# Altium schematic sheet SODIMM_Connector.SchDoc
size A3; CompanyName: Group 19 - AIgle; DrawnBy: Danny Huang; SheetNumber: 2; SheetTotal: 3
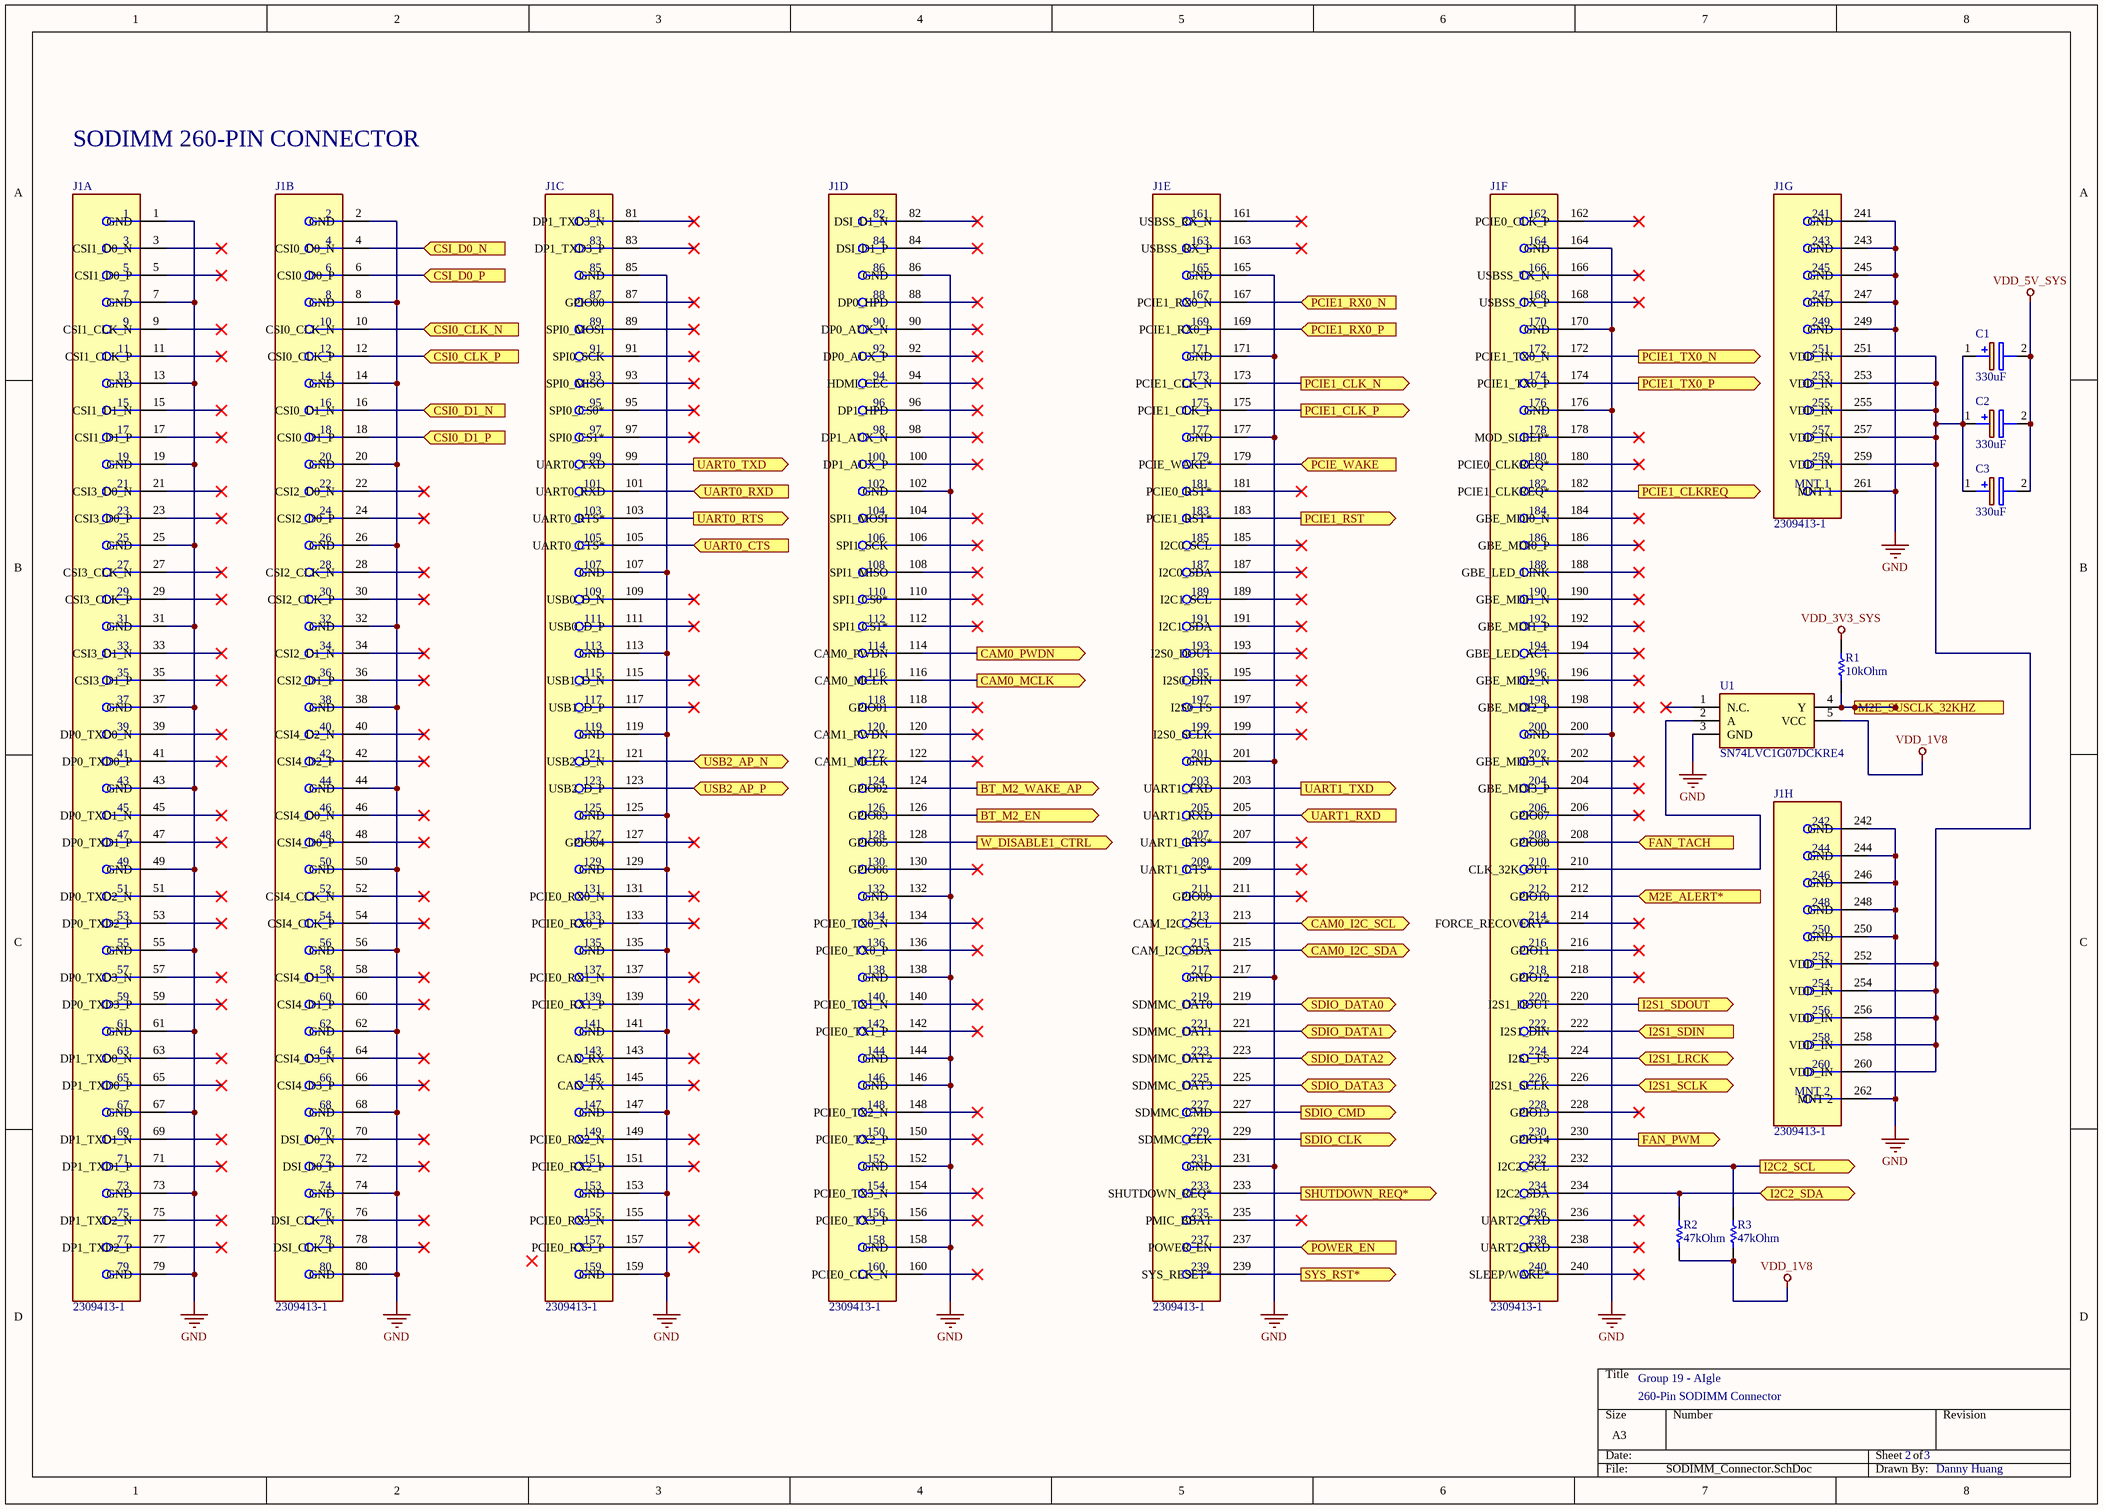
[diagram p0: SODIMM_Connector.SchDoc]

## Parts
C1  330uF  [CAPPM3528X210N]
C2  330uF  [CAPPM3528X210N]
C3  330uF  [CAPPM3528X210N]
J1  2309413-1  [FP-2309413-1-MFG]  (parts A,B,C,D,E,F,G,H of 8)
R1  10kOhm  [RESC1005X40X25NL05T05]
R2  47kOhm  [RESC1005X40X25LL05T05]
R3  47kOhm  [RESC1005X40X25LL05T05]
U1  SN74LVC1G07DCKRE4  [SOT65P210X110-5N]

## Ports
BT_M2_EN (out), BT_M2_WAKE_AP (out), CAM0_I2C_SCL (bidir), CAM0_I2C_SDA (bidir), CAM0_MCLK (out), CAM0_PWDN (out), CSI0_CLK_N (in), CSI0_CLK_P (in), CSI0_D1_N (in), CSI0_D1_P (in), CSI_D0_N (in), CSI_D0_P (in), FAN_PWM (out), FAN_TACH (in), I2C2_SCL (out), I2C2_SDA (bidir), I2S1_LRCK (bidir), I2S1_SCLK (bidir), I2S1_SDIN (in), I2S1_SDOUT (out), M2E_ALERT* (in), M2E_SUSCLK_32KHZ (out), PCIE1_CLK_N (out), PCIE1_CLK_P (out), PCIE1_CLKREQ (out), PCIE1_RST (out), PCIE1_RX0_N (in), PCIE1_RX0_P (in), PCIE1_TX0_N (out), PCIE1_TX0_P (out), PCIE_WAKE (in), POWER_EN (in), SDIO_CLK (out), SDIO_CMD (out), SDIO_DATA0 (bidir), SDIO_DATA1 (bidir), SDIO_DATA2 (bidir), SDIO_DATA3 (bidir), SHUTDOWN_REQ* (out), SYS_RST* (out), UART0_CTS (in), UART0_RTS (out), UART0_RXD (in), UART0_TXD (out), UART1_RXD (in), UART1_TXD (out), USB2_AP_N (bidir), USB2_AP_P (bidir), W_DISABLE1_CTRL (out)

## Nets
GND: J1.1(GND) J1.2(GND) J1.7(GND) J1.8(GND) J1.13(GND) J1.14(GND) J1.19(GND) J1.20(GND) J1.25(GND) J1.26(GND) J1.31(GND) J1.32(GND) J1.37(GND) J1.38(GND) J1.43(GND) J1.44(GND) J1.49(GND) J1.50(GND) J1.55(GND) J1.56(GND) J1.61(GND) J1.62(GND) J1.67(GND) J1.68(GND) J1.73(GND) J1.74(GND) J1.79(GND) J1.80(GND) J1.85(GND) J1.86(GND) J1.102(GND) J1.107(GND) J1.113(GND) J1.119(GND) J1.125(GND) J1.129(GND) J1.132(GND) J1.135(GND) J1.138(GND) J1.141(GND) J1.144(GND) J1.146(GND) J1.147(GND) J1.152(GND) J1.153(GND) J1.158(GND) J1.159(GND) J1.164(GND) J1.165(GND) J1.170(GND) J1.171(GND) J1.176(GND) J1.177(GND) J1.200(GND) J1.201(GND) J1.217(GND) J1.231(GND) J1.241(GND) J1.242(GND) J1.243(GND) J1.244(GND) J1.245(GND) J1.246(GND) J1.247(GND) J1.248(GND) J1.249(GND) J1.250(GND) J1.261(MNT_1) J1.262(MNT_2) U1.3(GND)
VDD_1V8: R2.1 R3.1 U1.5(VCC)
VDD_3V3_SYS: R1.2
VDD_5V_SYS: C1.2(-) C2.2(-) C3.2(-)
BT_M2_EN: J1.126(GPIO03) ; port BT_M2_EN
BT_M2_WAKE_AP: J1.124(GPIO02) ; port BT_M2_WAKE_AP
CAM0_I2C_SCL: J1.213(CAM_I2C_SCL) ; port CAM0_I2C_SCL
CAM0_I2C_SDA: J1.215(CAM_I2C_SDA) ; port CAM0_I2C_SDA
CAM0_MCLK: J1.116(CAM0_MCLK) ; port CAM0_MCLK
CAM0_PWDN: J1.114(CAM0_PWDN) ; port CAM0_PWDN
CSI0_CLK_N: J1.10(CSI0_CLK_N) ; port CSI0_CLK_N
CSI0_CLK_P: J1.12(CSI0_CLK_P) ; port CSI0_CLK_P
CSI0_D1_N: J1.16(CSI0_D1_N) ; port CSI0_D1_N
CSI0_D1_P: J1.18(CSI0_D1_P) ; port CSI0_D1_P
CSI_D0_N: J1.4(CSI0_D0_N) ; port CSI_D0_N
CSI_D0_P: J1.6(CSI0_D0_P) ; port CSI_D0_P
FAN_PWM: J1.230(GPIO14) ; port FAN_PWM
FAN_TACH: J1.208(GPIO08) ; port FAN_TACH
I2C2_SCL: J1.232(I2C2_SCL) R3.2 ; port I2C2_SCL
I2C2_SDA: J1.234(I2C2_SDA) R2.2 ; port I2C2_SDA
I2S1_LRCK: J1.224(I2S1_FS) ; port I2S1_LRCK
I2S1_SCLK: J1.226(I2S1_SCLK) ; port I2S1_SCLK
I2S1_SDIN: J1.222(I2S1_DIN) ; port I2S1_SDIN
I2S1_SDOUT: J1.220(I2S1_DOUT) ; port I2S1_SDOUT
M2E_ALERT*: J1.212(GPIO10) ; port M2E_ALERT*
M2E_SUSCLK_32KHZ: R1.1 U1.4(Y) ; port M2E_SUSCLK_32KHZ
PCIE1_CLK_N: J1.173(PCIE1_CLK_N) ; port PCIE1_CLK_N
PCIE1_CLK_P: J1.175(PCIE1_CLK_P) ; port PCIE1_CLK_P
PCIE1_CLKREQ: J1.182(PCIE1_CLKREQ*) ; port PCIE1_CLKREQ
PCIE1_RST: J1.183(PCIE1_RST*) ; port PCIE1_RST
PCIE1_RX0_N: J1.167(PCIE1_RX0_N) ; port PCIE1_RX0_N
PCIE1_RX0_P: J1.169(PCIE1_RX0_P) ; port PCIE1_RX0_P
PCIE1_TX0_N: J1.172(PCIE1_TX0_N) ; port PCIE1_TX0_N
PCIE1_TX0_P: J1.174(PCIE1_TX0_P) ; port PCIE1_TX0_P
PCIE_WAKE: J1.179(PCIE_WAKE*) ; port PCIE_WAKE
POWER_EN: J1.237(POWER_EN) ; port POWER_EN
SDIO_CLK: J1.229(SDMMC_CLK) ; port SDIO_CLK
SDIO_CMD: J1.227(SDMMC_CMD) ; port SDIO_CMD
SDIO_DATA0: J1.219(SDMMC_DAT0) ; port SDIO_DATA0
SDIO_DATA1: J1.221(SDMMC_DAT1) ; port SDIO_DATA1
SDIO_DATA2: J1.223(SDMMC_DAT2) ; port SDIO_DATA2
SDIO_DATA3: J1.225(SDMMC_DAT3) ; port SDIO_DATA3
SHUTDOWN_REQ*: J1.233(SHUTDOWN_REQ*) ; port SHUTDOWN_REQ*
SYS_RST*: J1.239(SYS_RESET*) ; port SYS_RST*
UART0_CTS: J1.105(UART0_CTS*) ; port UART0_CTS
UART0_RTS: J1.103(UART0_RTS*) ; port UART0_RTS
UART0_RXD: J1.101(UART0_RXD) ; port UART0_RXD
UART0_TXD: J1.99(UART0_TXD) ; port UART0_TXD
UART1_RXD: J1.205(UART1_RXD) ; port UART1_RXD
UART1_TXD: J1.203(UART1_TXD) ; port UART1_TXD
USB2_AP_N: J1.121(USB2_D_N) ; port USB2_AP_N
USB2_AP_P: J1.123(USB2_D_P) ; port USB2_AP_P
W_DISABLE1_CTRL: J1.128(GPIO05) ; port W_DISABLE1_CTRL
NetC1_1: C1.1(+) C2.1(+) C3.1(+) J1.251(VDD_IN) J1.252(VDD_IN) J1.253(VDD_IN) J1.254(VDD_IN) J1.255(VDD_IN) J1.256(VDD_IN) J1.257(VDD_IN) J1.258(VDD_IN) J1.259(VDD_IN) J1.260(VDD_IN)
NetJ1_210: J1.210(CLK_32K_OUT) U1.2(A)

Not connected (* = marked no-connect by the designer): J1 3(CSI1_D0_N)* 5(CSI1_D0_P)* 9(CSI1_CLK_N)* 11(CSI1_CLK_P)* 15(CSI1_D1_N)* 17(CSI1_D1_P)* 21(CSI3_D0_N)* 22(CSI2_D0_N)* 23(CSI3_D0_P)* 24(CSI2_D0_P)* 27(CSI3_CLK_N)* 28(CSI2_CLK_N)* 29(CSI3_CLK_P)* 30(CSI2_CLK_P)* 33(CSI3_D1_N)* 34(CSI2_D1_N)* 35(CSI3_D1_P)* 36(CSI2_D1_P)* 39(DP0_TXD0_N)* 40(CSI4_D2_N)* 41(DP0_TXD0_P)* 42(CSI4_D2_P)* 45(DP0_TXD1_N)* 46(CSI4_D0_N)* 47(DP0_TXD1_P)* 48(CSI4_D0_P)* 51(DP0_TXD2_N)* 52(CSI4_CLK_N)* 53(DP0_TXD2_P)* 54(CSI4_CLK_P)* 57(DP0_TXD3_N)* 58(CSI4_D1_N)* 59(DP0_TXD3_P)* 60(CSI4_D1_P)* 63(DP1_TXD0_N)* 64(CSI4_D3_N)* 65(DP1_TXD0_P)* 66(CSI4_D3_P)* 69(DP1_TXD1_N)* 70(DSI_D0_N)* 71(DP1_TXD1_P)* 72(DSI_D0_P)* 75(DP1_TXD2_N)* 76(DSI_CLK_N)* 77(DP1_TXD2_P)* 78(DSI_CLK_P)* 81(DP1_TXD3_N)* 82(DSI_D1_N)* 83(DP1_TXD3_P)* 84(DSI_D1_P)* 87(GPIO00)* 88(DP0_HPD)* 89(SPI0_MOSI)* 90(DP0_AUX_N)* 91(SPI0_SCK)* 92(DP0_AUX_P)* 93(SPI0_MISO)* 94(HDMI_CEC)* 95(SPI0_CS0*)* 96(DP1_HPD)* 97(SPI0_CS1*)* 98(DP1_AUX_N)* 100(DP1_AUX_P)* 104(SPI1_MOSI)* 106(SPI1_SCK)* 108(SPI1_MISO)* 109(USB0_D_N)* 110(SPI1_CS0*)* 111(USB0_D_P)* 112(SPI1_CS1*)* 115(USB1_D_N)* 117(USB1_D_P)* 118(GPIO01)* 120(CAM1_PWDN)* 122(CAM1_MCLK)* 127(GPIO04)* 130(GPIO06)* 131(PCIE0_RX0_N)* 133(PCIE0_RX0_P)* 134(PCIE0_TX0_N)* 136(PCIE0_TX0_P)* 137(PCIE0_RX1_N)* 139(PCIE0_RX1_P)* 140(PCIE0_TX1_N)* 142(PCIE0_TX1_P)* 143(CAN_RX)* 145(CAN_TX)* 148(PCIE0_TX2_N)* 149(PCIE0_RX2_N)* 150(PCIE0_TX2_P)* 151(PCIE0_RX2_P)* 154(PCIE0_TX3_N)* 155(PCIE0_RX3_N)* 156(PCIE0_TX3_P)* 157(PCIE0_RX3_P)* 160(PCIE0_CLK_N)* 161(USBSS_RX_N)* 162(PCIE0_CLK_P)* 163(USBSS_RX_P)* 166(USBSS_TX_N)* 168(USBSS_TX_P)* 178(MOD_SLEEP*)* 180(PCIE0_CLKREQ*)* 181(PCIE0_RST*)* 184(GBE_MDI0_N)* 185(I2C0_SCL)* 186(GBE_MDI0_P)* 187(I2C0_SDA)* 188(GBE_LED_LINK)* 189(I2C1_SCL)* 190(GBE_MDI1_N)* 191(I2C1_SDA)* 192(GBE_MDI1_P)* 193(I2S0_DOUT)* 194(GBE_LED_ACT)* 195(I2S0_DIN)* 196(GBE_MDI2_N)* 197(I2S0_FS)* 198(GBE_MDI2_P)* 199(I2S0_SCLK)* 202(GBE_MDI3_N)* 204(GBE_MDI3_P)* 206(GPIO07)* 207(UART1_RTS*)* 209(UART1_CTS*)* 211(GPIO09)* 214(FORCE_RECOVERY*)* 216(GPIO11)* 218(GPIO12)* 228(GPIO13)* 235(PMIC_BBAT)* 236(UART2_TXD)* 238(UART2_RXD)* 240(SLEEP/WAKE*)*; U1 1(N.C.)*

## Notes on the sheet
- SODIMM 260-PIN CONNECTOR
- 260-Pin SODIMM Connector

## Library data of the parts
C1-C3 = T520B337M006ATE040: Capacitor Polarised; Manufacturer_Name: Kemet; Datasheet Link: http://componentsearchengine.com/Datasheets/2/T520B337M006ATE040.pdf; Height: 2.1mm; Manufacturer_Part_Number: T520B337M006ATE040; Arrow Part Number: T520B337M006ATE040; Arrow Price/Stock: https://www.arrow.com/en/products/t520b337m006ate040/kemet-corporation; Mouser Part Number: 80-T520B337M06ATE040; Mouser Price/Stock: https://www.mouser.com/Search/Refine.aspx?Keyword=80-T520B337M06ATE040
J1 = CMP-03356-000001-1: DDR4 SODIMM 260P 9.2H STD; Manufacturer: TE Connectivity; Voltage Rating: 25V; Current Rating: 0.5A; Is Female: yes; Pitch: 0.5mm; Memory Type: SDRAM,DDR; Conn Orientation: Horizontal; Number Of Contacts: 260; Temperature: -55°C to +85°C; Octopart: https://octopart.com/2309413-1-te+connectivity-84799194; Device Class L3: unset; Contact Material: Gold,Nickel; ComponentLink2URL: https://www.te.com/commerce/DocumentDelivery/DDEController?Action=showdoc&DocId=Specification+Or+Standard%7F108-115122%7FA1%7Fpdf%7FEnglish%7FENG_SS_108-115122_A1.pdf%7F2309413-1; Manufacturer Part Number: 2309413-1; ComponentLink2Description: Datasheet; Digikey Description: DDR4 SODIMM 260P 9.2H STD; Height: 18.8mm; Footprint Url: https://www.te.com/commerce/DocumentDelivery/DDEController?Action=showdoc&DocId=Customer+Drawing%7F2309413%7F4%7Fpdf%7FEnglish%7FENG_CD_2309413_4.pdf%7F2309413-1; Temperature Range Low: -55°C; Device Class L2: Memory Connectors; Temperature Range High: +85°C; RoHS: TRUE; Automotive: No; Device Class L1: Connectors; Mouser Description: Conn DDR4 DIMM Socket SKT 260 POS 0.5mm Solder RA SMD T/R; Category: Conn; Package: 0; Lead Free: Yes
R1 = CMP-2002-08136-1: Manufacturer: Vishay Dale; Part Number: CRCW040210K0JNED
R2 R3 = CMP-2002-00026-1: Manufacturer: Vishay Dale; Part Number: CRCW040247K0JNED
U1 = SN74LVC1G07DCKRE4: Integrated Circuit; Manufacturer_Name: Texas Instruments; Datasheet Link: http://www.ti.com/lit/ds/symlink/sn74lvc1g07.pdf; Height: 1.1mm; Manufacturer_Part_Number: SN74LVC1G07DCKRE4; Arrow Part Number: SN74LVC1G07DCKRE4; Arrow Price/Stock: https://www.arrow.com/en/products/sn74lvc1g07dckre4/texas-instruments; Mouser Part Number: 595-SN74LVC1G07DCKE4; Mouser Price/Stock: https://www.mouser.co.uk/ProductDetail/Texas-Instruments/SN74LVC1G07DCKRE4?qs=pajgIaoyDUhxFR39KLTAuA%3D%3D